# EAGLE design MobSenDat2 (EAGLE 5.11)
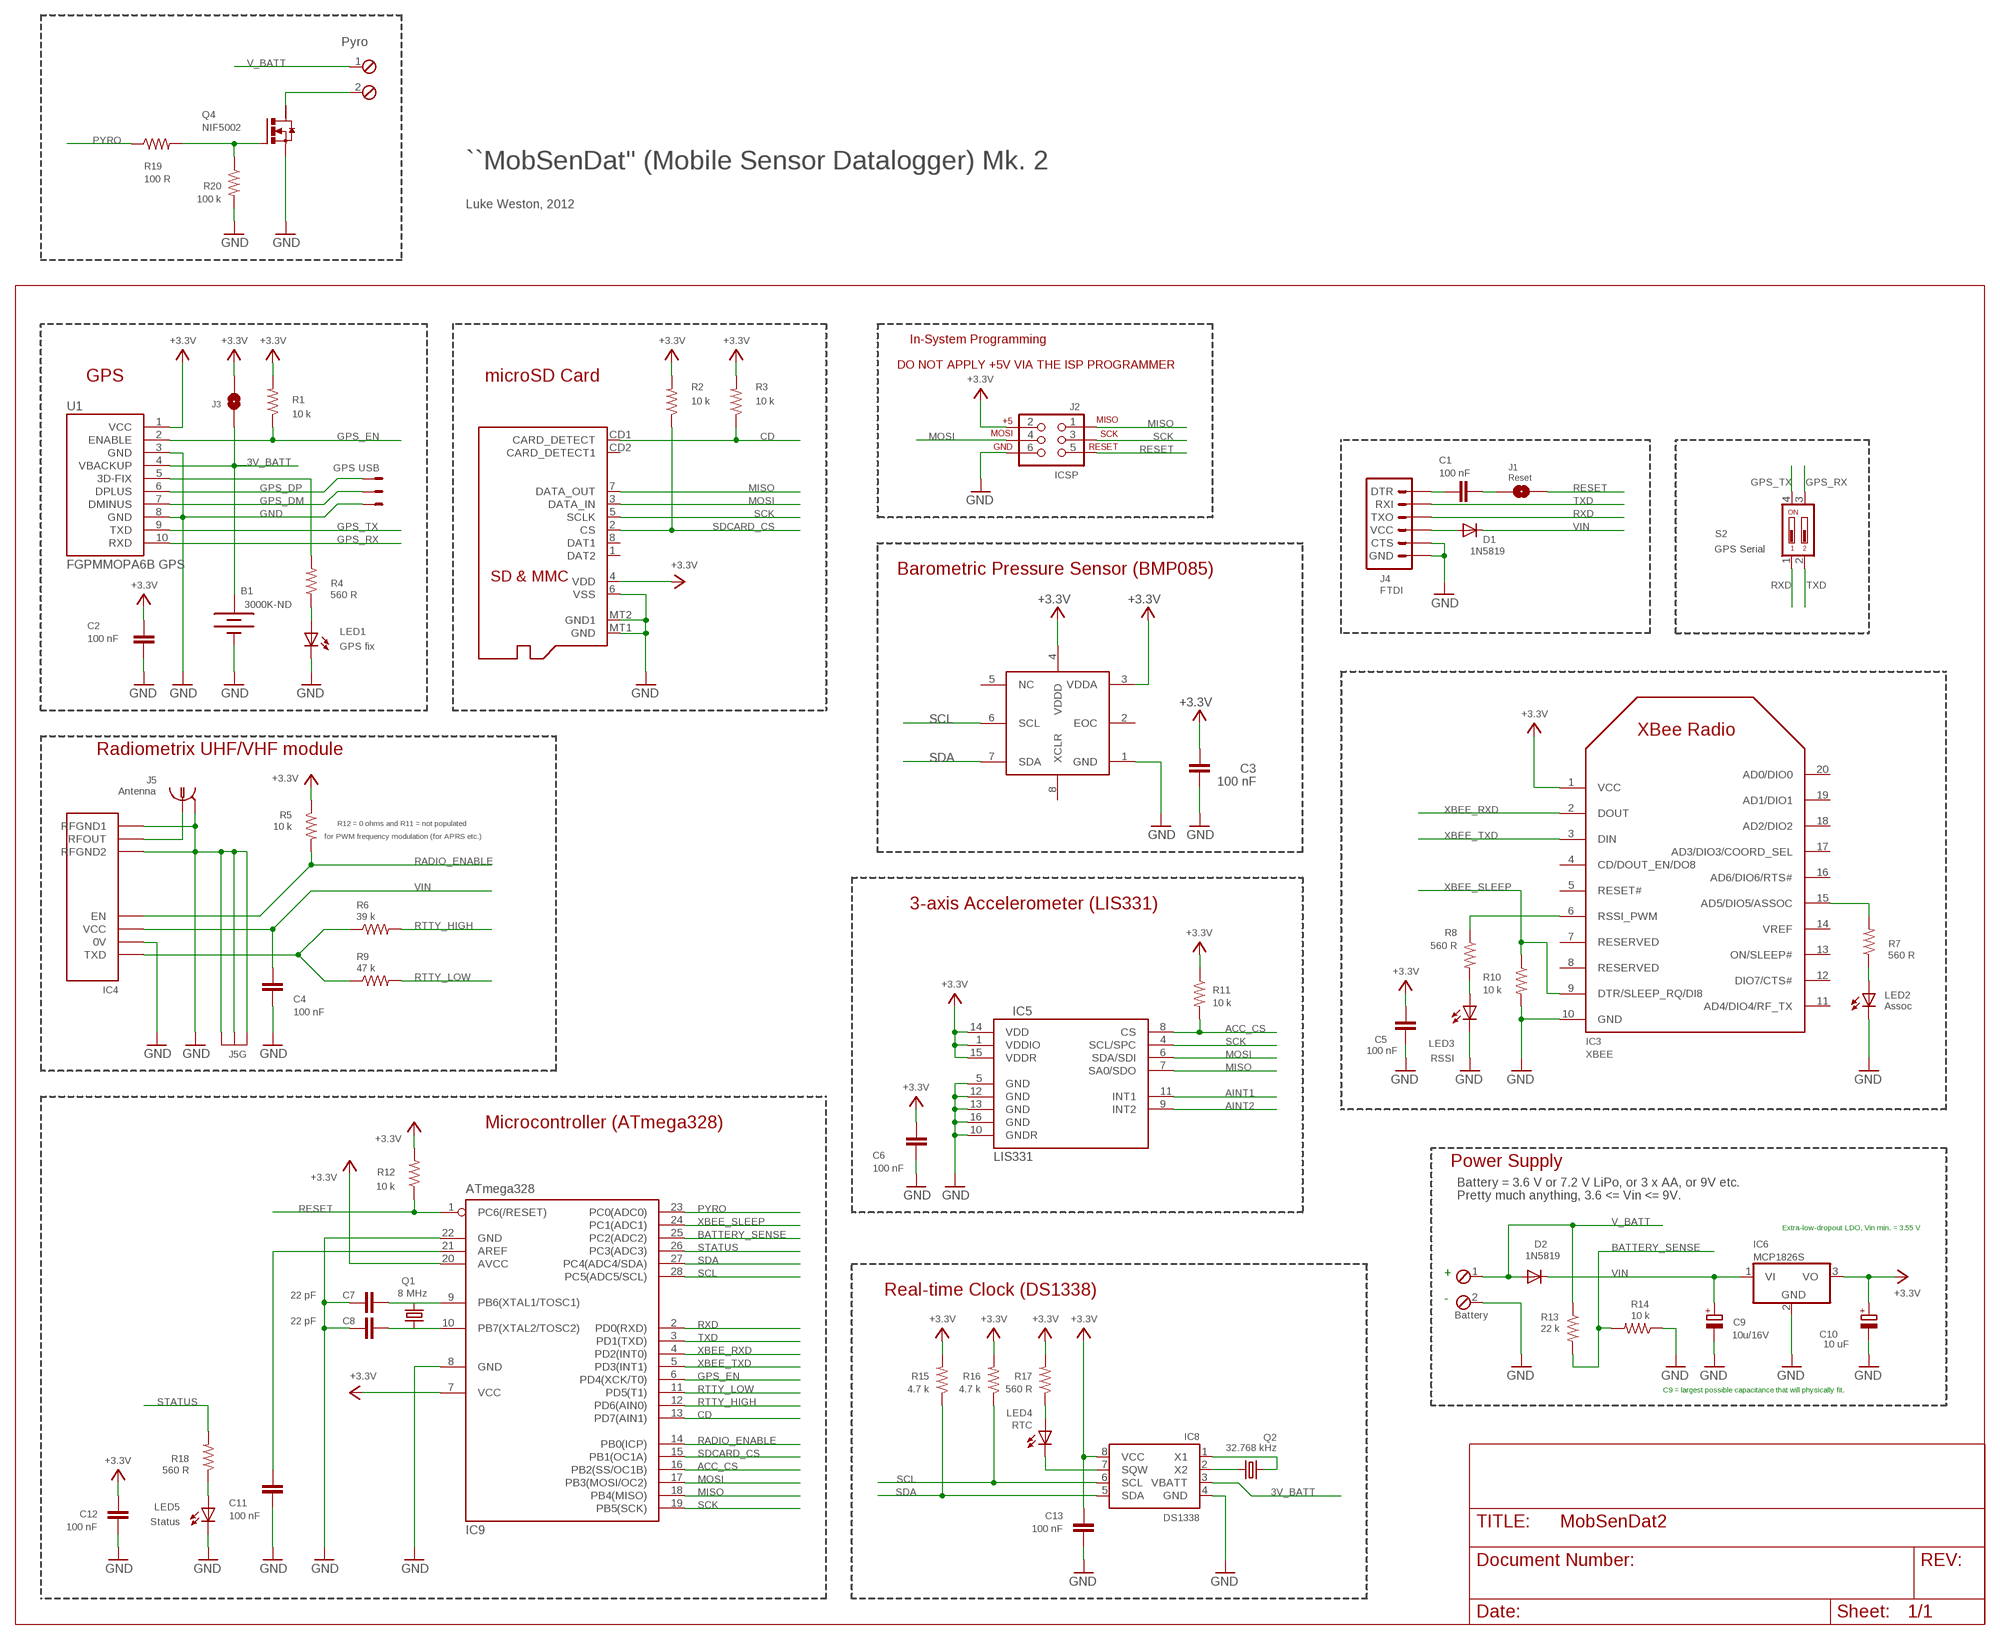
[diagram p0: schematic, sheet 1]

## Parts
B1  3000K-ND  BATTERY12MM  [BATTCON_12MM]
C1  100 nF  C-EU025-024X044  [C025-024X044]
C2  100 nF  C-EU025-024X044  [C025-024X044]
C3  100 nF  C-EU025-024X044  [C025-024X044]
C4  100 nF  C-EU025-024X044  [C025-024X044]
C5  100 nF  C-EU025-024X044  [C025-024X044]
C6  100 nF  C-EU025-024X044  [C025-024X044]
C7  22 pF  C-EU025-024X044  [C025-024X044]
C8  22 pF  C-EU025-024X044  [C025-024X044]
C9  10u/16V  CPOL-EUE2.5-5  [E2,5-5]
C10  10 uF  CPOL-EUE2.5-5  [E2,5-5]
C11  100 nF  C-EU025-024X044  [C025-024X044]
C12  100 nF  C-EU025-024X044  [C025-024X044]
C13  100 nF  C-EU025-024X044  [C025-024X044]
D1  1N5819  DIODE-DO35-10  [DO35-10]
D2  1N5819  DIODE-DO35-10  [DO35-10]
IC2  BMP085  [BMP085]
IC3  XBEE  XBEE-PRO  [XBEE-PRO]
IC4  HX1  [HX1]
IC5  LIS331  [LGA16-3MM]
IC6  MCP1826S  MCP1703DB  [SOT223]
IC8  DS1338  DS1307SO8  [SO08]
IC9  ATmega328  MEGA8-P  [DIL28-3]
J1  Reset  SJ  [SJ]
J2  ICSP  AVR_SPI_PRG_6PTH  [2X3]
J3  SJ  [SJ]
J4  FTDI  ARDUINO_SERIAL_PROGRAMLONGPADS  [1X06_LONGPADS]
J5  Antenna  LTI-SASF54GT  [LTI-SASF54GT]
LED1  GPS fix  LED3MM  [LED3MM]
LED2  Assoc  LED3MM  [LED3MM]
LED3  RSSI  LED3MM  [LED3MM]
LED4  RTC  LED3MM  [LED3MM]
LED5  Status  LED3MM  [LED3MM]
Q1  8 MHz  CRYSTALHC49UV  [HC49U-V]
Q2  32.768 kHz  CRYSTALTC38H  [TC38H]
Q4  NIF5002  N-HEXFET-2D_SOT232-  [SOT223]
R1  10 k  R-US_0207/10  [0207/10]
R2  10 k  R-US_0207/10  [0207/10]
R3  10 k  R-US_0207/10  [0207/10]
R4  560 R  R-US_0207/10  [0207/10]
R5  10 k  R-US_0207/10  [0207/10]
R6  39 k  R-US_0207/10  [0207/10]
R7  560 R  R-US_0207/10  [0207/10]
R8  560 R  R-US_0207/10  [0207/10]
R9  47 k  R-US_0207/10  [0207/10]
R10  10 k  R-US_0207/10  [0207/10]
R11  10 k  R-US_0207/10  [0207/10]
R12  10 k  R-US_0207/10  [0207/10]
R13  22 k  R-US_0207/10  [0207/10]
R14  10 k  R-US_0207/10  [0207/10]
R15  4.7 k  R-US_0207/10  [0207/10]
R16  4.7 k  R-US_0207/10  [0207/10]
R17  560 R  R-US_0207/10  [0207/10]
R18  560 R  R-US_0207/10  [0207/10]
R19  100 R  R-US_0207/10  [0207/10]
R20  100 k  R-US_0207/10  [0207/10]
S2  GPS Serial  DIP02YL  [DIP02YL]
U1  FGPMMOPA6B GPS  OPENPILOT_FGPMMOPA6B  [OPENPILOT_GTOP-FGPMMOPA6B]
U$1  MICROSD  [MICROSD]
X1  GPS USB  22-23-2031  [22-23-2031]
X2  Battery  MPT2  [2POL254]
X3  Pyro  MPT2  [2POL254]

## Nets
3V_BATT: B1.PWR@1(+) IC8.3(VBATT) J3.1 U1.4(VBACKUP)
+3.3V: C2.2 C3.2 C5.2 C6.1 C10.+ C12.2 C13.1 IC2.3(VDDA) IC2.4(VDDD) IC3.1(VCC) IC5.1(VDDIO) IC5.14(VDD) IC5.15(VDDR) IC6.3(VO) IC8.8(VCC) IC9.7(VCC) IC9.20(AVCC) J2.2 J3.2 R1.2 R2.2 R3.2 R5.1 R11.1 R12.2 R15.2 R16.2 R17.2 U1.1(VCC) U$1.4(VDD)
ACC_CS: IC5.8(CS) IC9.16(PB2(SS/OC1B)) R11.2
AINT1: IC5.11(INT1)
AINT2: IC5.9(INT2)
BATTERY_SENSE: IC9.25(PC2(ADC2)) R13.2 R14.2
CD: IC9.13(PD7(AIN1)) R3.1 U$1.CD1(CARD_DETECT)
GND: B1.GND(-) C2.1 C3.1 C4.1 C5.1 C6.2 C7.1 C8.1 C9.- C10.- C11.1 C12.1 C13.2 IC2.1(GND) IC3.10(GND) IC4.0V IC4.RFGND1 IC4.RFGND2 IC5.5(GND) IC5.10(GNDR) IC5.12(GND) IC5.13(GND) IC5.16(GND) IC6.2(GND) IC8.4(GND) IC9.8(GND) IC9.22(GND) J2.6 J4.5(CTS) J4.6(GND) J5.2(GND) J5.3(GND) J5.4(GND) J5.5(GND) LED1.K(C) LED2.K(C) LED3.K(C) LED5.K(C) Q4.3(S) R10.2 R14.1 R20.2 U1.3(GND) U1.8(GND) U$1.6(VSS) U$1.MT1(GND) U$1.MT2(GND1) X1.3 X2.2
GPS_DM: U1.7(DMINUS) X1.2
GPS_DP: U1.6(DPLUS) X1.1
GPS_EN: IC9.6(PD4(XCK/T0)) R1.1 U1.2(ENABLE)
GPS_RX: S2.3 U1.10(RXD)
GPS_TX: S2.4 U1.9(TXD)
MISO: IC5.7(SA0/SDO) IC9.18(PB4(MISO)) J2.1 U$1.7(DATA_OUT)
MOSI: IC5.6(SDA/SDI) IC9.17(PB3(MOSI/OC2)) J2.4 U$1.3(DATA_IN)
N$1: C7.2 IC9.9(PB6(XTAL1/TOSC1)) Q1.2
N$2: C8.2 IC9.10(PB7(XTAL2/TOSC2)) Q1.1
N$3: C11.2 IC9.21(AREF)
N$4: C1.2 J4.1(DTR)
N$5: LED1.A R4.1
N$6: Q4.2(D) X3.2
N$7: D1.A J4.4(VCC)
N$8: Q4.1(G) R19.2 R20.1
N$10: IC4.RFOUT J5.1
N$14: IC8.1(X1) Q2.1
N$16: IC3.15(AD5/DIO5/ASSOC) R7.2
N$17: IC8.2(X2) Q2.2
N$19: IC3.6(RSSI_PWM) R8.1
N$21: LED3.A R8.2
N$22: LED2.A R7.1
N$23: LED5.A R18.1
N$26: LED4.A R17.1
N$28: IC8.7(SQW) LED4.K(C)
N$33: R4.2 U1.5(3D-FIX)
N$56: C1.1 J1.2
PYRO: IC9.23(PC0(ADC0)) R19.1
RADIO_ENABLE: IC4.EN IC9.14(PB0(ICP)) R5.2
RESET: IC9.1(PC6(/RESET)) J1.1 J2.5 R12.1
RTTY_HIGH: IC9.12(PD6(AIN0)) R6.2
RTTY_LOW: IC9.11(PD5(T1)) R9.2
RXD: IC9.2(PD0(RXD)) J4.3(TXO) S2.1
SCK: IC5.4(SCL/SPC) IC9.19(PB5(SCK)) J2.3 U$1.5(SCLK)
SCL: IC2.6(SCL) IC8.6(SCL) IC9.28(PC5(ADC5/SCL)) R16.1
SDA: IC2.7(SDA) IC8.5(SDA) IC9.27(PC4(ADC4/SDA)) R15.1
SDCARD_CS: IC9.15(PB1(OC1A)) R2.1 U$1.2(CS)
STATUS: IC9.26(PC3(ADC3)) R18.2
TXD: IC9.3(PD1(TXD)) J4.2(RXI) S2.2
TXD2: IC4.TXD R6.1 R9.1
V_BATT: D2.A R13.1 X2.1 X3.1
VIN: C4.2 C9.+ D1.C D2.C IC4.VCC IC6.1(VI)
XBEE_RXD: IC3.2(DOUT) IC9.4(PD2(INT0))
XBEE_SLEEP: IC3.9(DTR/SLEEP_RQ/DI8) IC9.24(PC1(ADC1)) R10.1
XBEE_TXD: IC3.3(DIN) IC9.5(PD3(INT1))
Unconnected: IC2.2(EOC) IC2.5(NC) IC2.8(XCLR) IC3.4(CD/DOUT_EN/DO8) IC3.5(RESET#) IC3.7(RESERVED) IC3.8(RESERVED) IC3.11(AD4/DIO4/RF_TX) IC3.12(DIO7/CTS#) IC3.13(ON/SLEEP#) IC3.14(VREF) IC3.16(AD6/DIO6/RTS#) IC3.17(AD3/DIO3/COORD_SEL) IC3.18(AD2/DIO2) IC3.19(AD1/DIO1) IC3.20(AD0/DIO0) Q4.4(D) U$1.1(DAT2) U$1.8(DAT1) U$1.CD2(CARD_DETECT1)

## Notes on the sheet
- ``MobSenDat" (Mobile Sensor Datalogger) Mk. 2
- Luke Weston, 2012
- In-System Programming
- GPS | DO NOT APPLY +5V VIA THE ISP PROGRAMMER
- microSD Card
- Barometric Pressure Sensor (BMP085)
- Radiometrix UHF/VHF module
- R12 = 0 ohms and R11 = not populated
- for PWM frequency modulation (for APRS etc.)
- 3-axis Accelerometer (LIS331)
- Microcontroller (ATmega328)
- Power Supply
- Battery = 3.6 V or 7.2 V LiPo, or 3 x AA, or 9V etc.
- Pretty much anything, 3.6 <= Vin <= 9V.
- Extra-low-dropout LDO, Vin min. = 3.55 V
- +
- Real-time Clock (DS1338)
- -
- C9 = largest possible capacitance that will physically fit.

## Library data of the parts
B1 = SparkFun:BATTERY: Battery Holders Various common sizes : AA, AAA, 20mm coin cell and 12mm coin cell.
C1-C8 C11-C13 = rcl:C-EU: CAPACITOR, European symbol
C9 C10 = rcl:CPOL-EU: POLARIZED CAPACITOR, European symbol
D1 D2 = diode:DIODE-: DIODE
IC2 = SparkFun:BMP085
IC3 = xbee_r1:XBEE
IC4 = trackuino:HX1
IC5 = SparkFun:LIS331: LIS331HH 3-axis accelerometer
IC6 = linear:MCP1703: 250 mA, 16V, Low Quiescent Current LDO Regulator Source: http://ww1.microchip.com/downloads/en/DeviceDoc/22049b.pdf
IC8 = SparkFun:DS1307
IC9 = atmel:MEGA8-P: MICROCONTROLLER 8 Kbytes FLASH, 1 kbytes SRAM, 512 bytes EEPROM, USART, 4-channel 10 bit ADC, 2-channel 8 bit ADC Pin compatible with Atmega48, ATMega88, ATMega168 Source: avr.lbr; OC_FARNELL: unknown; OC_NEWARK: unknown
J1 J3 = jumper:SJ: SMD solder JUMPER
J2 = SparkFun:AVR_SPI_PRG_6: AVR ISP 6 Pin This is the reduced ISP connector for AVR programming. Common on Arduino. This footprint will take up less PCB space and can be used with a 10-pin to 6-pin adapter such as SKU: BOB-08508
J4 = SparkFun:ARDUINO_SERIAL_PROGRAM
J5 = con-coax:LTI-SASF54GT: SMA vertical PCB thrue hole jack Source: Lighthorse Technologies, inc. SASF54GT.pdf; OC_FARNELL: unknown; OC_NEWARK: unknown
LED1-LED5 = led:LED: LED OSRAM: - CHIPLED LG R971, LG N971, LY N971, LG Q971, LY Q971, LO R971, LY R971 LH N974, LH R974 LS Q976, LO Q976, LY Q976 LO Q996 - Hyper CHIPLED LW Q18S LB Q993, LB Q99A, LB R99A - SideLED LS A670, LO A670, LY A670, LG A670, LP A670 LB A673, LV A673, LT A673, LW A673 LH A674 LY A675 LS A676, LA A676, LO A676, LY A676, LW A676 LS A679, LY A679, LG A679 - Hyper Micro SIDELED® LS Y876, LA Y876, LO Y876, LY Y876 LT Y87S - SmartLED LW L88C, LW L88S LB L89C, LB L89S, LG L890 LS L89K, LO L89K, LY L89K LS L896, LA L896, LO L896, LY L896 - TOPLED LS T670, LO T670, LY T670, LG T670, LP T670 LSG T670, LSP T670, LSY T670, LOP T670, LYG T670 LG T671, LOG T671, LSG T671 LB T673, LV T673, LT T673, LW T673 LH T674 LS T676, LA T676, LO T676, LY T676, LB T676, LH T676, LSB T676, LW T676 LB T67C, LV T67C, LT T67C, LS T67K, LO T67K, LY T67K, LW E67C LS E67B, LA E67B, LO E67B, LY E67B, LB E67C, LV E67C, LT E67C LW T67C LS T679, LY T679, LG T679 LS T770, LO T770, LY T770, LG T770, LP T770 LB T773, LV T773, LT T773, LW T773 LH T774 LS E675, LA E675, LY E675, LS T675 LS T776, LA T776, LO T776, LY T776, LB T776 LHGB T686 LT T68C, LB T68C - Hyper Mini TOPLED® LB M676 - Mini TOPLED Santana® LG M470 LS M47K, LO M47K, LY M47K Source: http://www.osram.convergy.de LUXEON: - LUMILED® LXK2-PW12-R00, LXK2-PW12-S00, LXK2-PW14-U00, LXK2-PW14-V00 LXK2-PM12-R00, LXK2-PM12-S00, LXK2-PM14-U00 LXK2-PE12-Q00, LXK2-PE12-R00, LXK2-PE12-S00, LXK2-PE14-T00, LXK2-PE14-U00 LXK2-PB12-K00, LXK2-PB12-L00, LXK2-PB12-M00, LXK2-PB14-N00, LXK2-PB14-P00, LXK2-PB14-Q00 LXK2-PR12-L00, LXK2-PR12-M00, LXK2-PR14-Q00, LXK2-PR14-R00 LXK2-PD12-Q00, LXK2-PD12-R00, LXK2-PD12-S00 LXK2-PH12-R00, LXK2-PH12-S00 LXK2-PL12-P00, LXK2-PL12-Q00, LXK2-PL12-R00 Source: www.luxeon.com KINGBRIGHT: KA-3528ASYC Source: www.kingbright.com
Q1 = SparkFun:CRYSTAL: Crystals Various standard crystals. Proven footprints. Spark Fun Electronics SKU : COM-00534
Q2 = crystal:CRYSTAL: CRYSTAL; OC_FARNELL: unknown; OC_NEWARK: unknown
Q4 = transistor-power:N-HEXFET-2D_?-*: HEXFET® Power MOSFET 2 Drain connects http://www.irf.com/product-info/datasheets/data/irll014n.pdf
R1-R20 = adafruit:R-US_: RESISTOR, American symbol
S2 = switch-dil:DIP02YL: DIL/CODE SWITCH; OC_FARNELL: unknown; OC_NEWARK: unknown
U1 = MobSenDat2:OPENPILOT_FGPMMOPA6B: GTOP FGPMMOPA6B GPS POT (Patch-On-Top) Module 66-channel GPS Engine Board
U$1 = adafruit:MICROSD: Micro-SD / Transflash card holder with SPI pinout For the 3M # 2908-05WB-MG and/or 4UCON #19656 push-push type
X1 = con-molex:22-23-2031: .100" (2.54mm) Center Header - 3 Pin; MF: MOLEX; MPN: 22-23-2031; OC_FARNELL: 1462950; OC_NEWARK: 30C0862
X2 X3 = con-phoenix-254:MPT2: PHOENIX CONNECTOR; OC_FARNELL: unknown; OC_NEWARK: unknown

## Net classes
1 vcc: width 0.254 mm

## Board
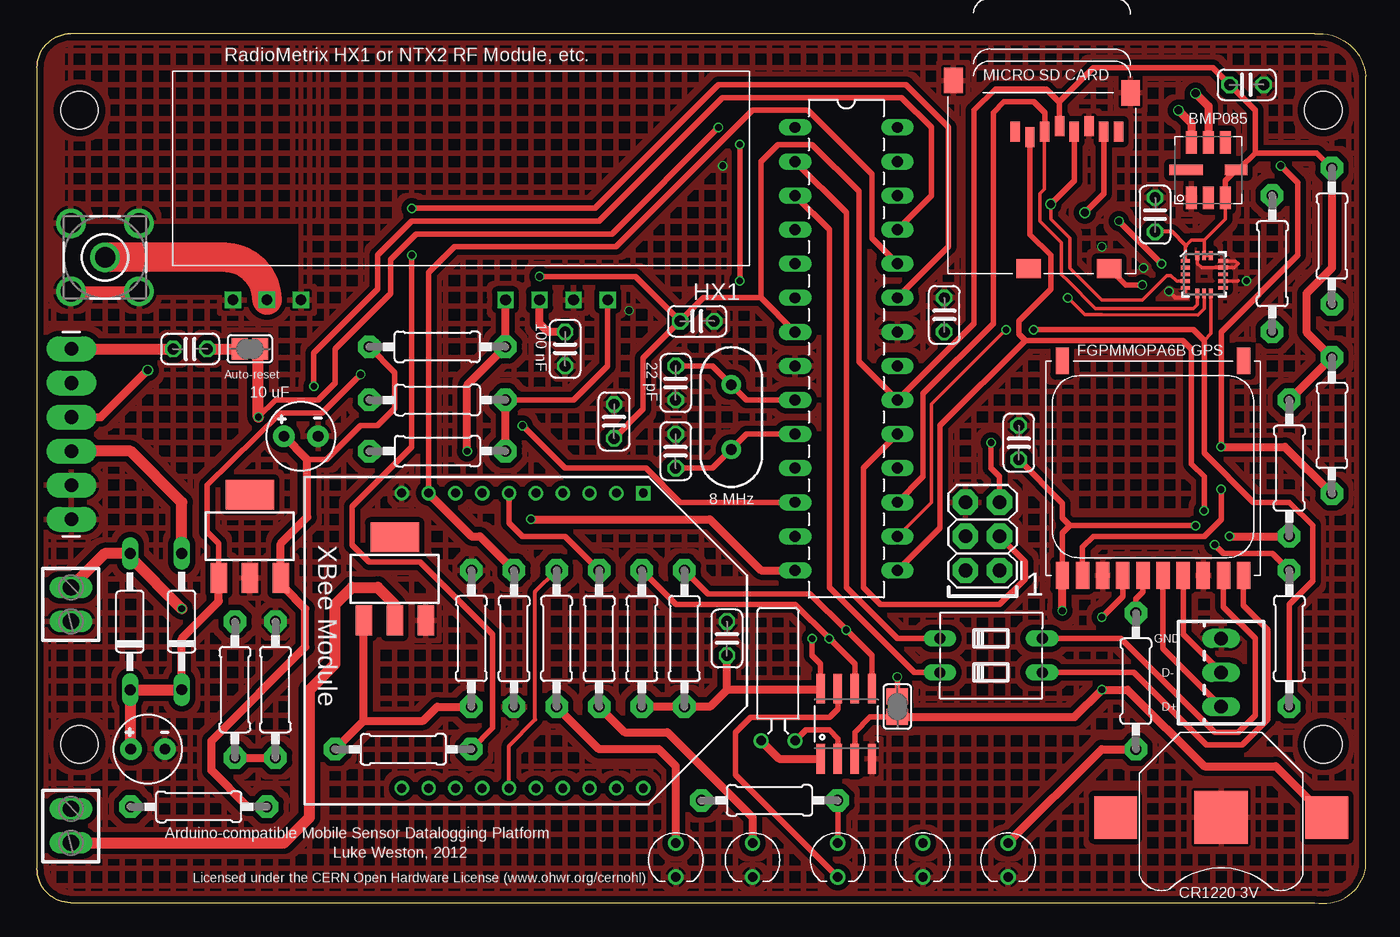
[diagram p1: board, top side]
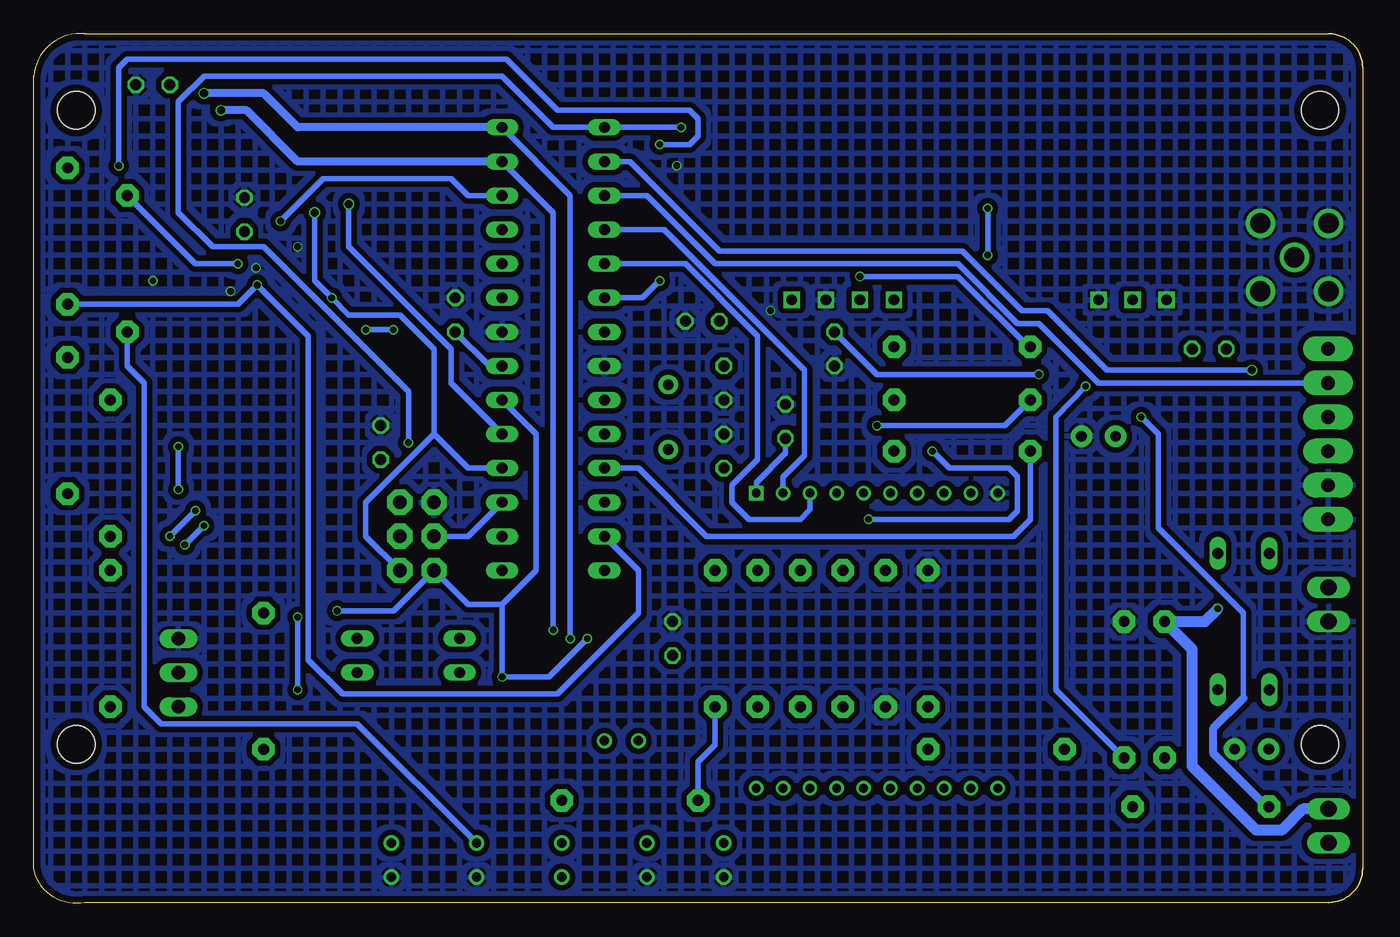
[diagram p2: board, bottom side, seen from below]

Size 99.06 x 64.85 mm. Coordinates in mm from the lower left corner, seen from the top.
Outline: 0,2.6 arc90 2.54,0.06
Outline: 2.54,0.06 arc-90 0,2.6
Outline: 0,62.29 arc-90 2.54,64.83
Outline: 2.54,64.83 arc90 0,62.29
Outline: 0,62.29 0,2.6
Outline: 2.54,64.83 95.25,64.83 arc-90 99.06,61.66 99.06,2.6 arc-90 95.25,0.06 2.54,0.06
Copper layers (1*16): Top 0.035mm / dielectric 1.5mm / Bottom 0.035mm
Design rules "PCBCart-.3mmHoles-.1mmAnnulars": minimum track width 8mil, minimum drill 0.3mm, track to track 8mil, track to pad 8mil, pad to pad 8mil, via to via 8mil, smd to smd 8mil, copper to edge 20mil, drill to drill 8mil, minimum pad ring 8mil, minimum via ring 4mil, stop-mask expansion 3mil, vias tented up to drill 0mil, thermal gap 8mil
Holes 2.8 mm at 3.17,11.87 95.89,59.12 3.17,59.12 95.89,11.87

### Footprints (pad centres in the part's own frame; a part is rotated, then mirrored left to right if it is on the bottom)
BATTCON_12MM = smd 3.962 x 3.962: GND 0,0 | smd 3.175 x 3.175: PWR@1 -7.874,0; PWR@2 7.874,0
C025-024X044 = drill 0.813 octagon: 1 -1.27,0; 2 1.27,0
E2,5-5 = drill 0.8 pad 1.6 round: + -1.27,0; - 1.27,0
DO35-10 = drill 0.813 long: A 5.08,0; C -5.08,0
BMP085 = smd 1.67 x 0.8: 1 -2.065,1.27; 2 -2.065,0; 3 -2.065,-1.27; 5 2.065,-1.27; 6 2.065,0; 7 2.065,1.27 | smd 0.8 x 1.67: 4 0,-2.065 | smd 0.8 x 2.5: 8 0,1.65
XBEE-PRO = drill 0.66 square: 1 -11,9 | drill 0.66 round: 2 -11,7; 3 -11,5; 4 -11,3; 5 -11,1; 6 -11,-1; 7 -11,-3; 8 -11,-5; 9 -11,-7; 10 -11,-9; 11 11,-9; 12 11,-7; 13 11,-5; 14 11,-3; 15 11,-1; 16 11,1; 17 11,3; 18 11,5; 19 11,7; 20 11,9
HX1 = drill 0.8 square: 0V 25.4,-8.89; EN 20.32,-8.89; RFGND1 0,-8.89; RFGND2 5.08,-8.89; RFOUT 2.54,-8.89; TXD 27.94,-8.89; VCC 22.86,-8.89
LGA16-3MM = smd 0.7 x 0.28: 1 -1.4,1; 2 -1.4,0.5; 3 -1.4,0; 4 -1.4,-0.5; 5 -1.4,-1; 9 1.4,-1; 10 1.4,-0.5; 11 1.4,0; 12 1.4,0.5; 13 1.4,1 | smd 0.28 x 0.7: 6 -0.5,-1.4; 7 0,-1.4; 8 0.5,-1.4; 14 0.5,1.4; 15 0,1.4; 16 -0.5,1.4
SOT223 = smd 1.219 x 2.235: 1 -2.311,-3.099; 2 0,-3.099; 3 2.311,-3.099 | smd 3.6 x 2.2: 4 0,3.099
SO08 = smd 0.61 x 2.21: 1 -1.905,-2.616; 2 -0.635,-2.616; 3 0.635,-2.616; 4 1.905,-2.616; 5 1.905,2.616; 6 0.635,2.616; 7 -0.635,2.616; 8 -1.905,2.616
DIL28-3 = drill 0.813 long: 1 -16.51,-3.81; 2 -13.97,-3.81; 3 -11.43,-3.81; 4 -8.89,-3.81; 5 -6.35,-3.81; 6 -3.81,-3.81; 7 -1.27,-3.81; 8 1.27,-3.81; 9 3.81,-3.81; 10 6.35,-3.81; 11 8.89,-3.81; 12 11.43,-3.81; 13 13.97,-3.81; 14 16.51,-3.81; 15 16.51,3.81; 16 13.97,3.81; 17 11.43,3.81; 18 8.89,3.81; 19 6.35,3.81; 20 3.81,3.81; 21 1.27,3.81; 22 -1.27,3.81; 23 -3.81,3.81; 24 -6.35,3.81; 25 -8.89,3.81; 26 -11.43,3.81; 27 -13.97,3.81; 28 -16.51,3.81
SJ = smd 1.168 x 1.6: 1 -0.762,0; 2 0.762,0
2X3 = drill 1.016 pad 1.88 octagon: 1 0,0; 2 0,2.54; 3 2.54,0; 4 2.54,2.54; 5 5.08,0; 6 5.08,2.54
1X06_LONGPADS = drill 1.016 pad 1.88 long: 1 0,0; 2 2.54,0; 3 5.08,0; 4 7.62,0; 5 10.16,0; 6 12.7,0
LTI-SASF54GT = drill 1.5 pad 2.2 round: 1 0,0; 2 -2.54,2.54; 3 2.54,2.54; 4 2.54,-2.54; 5 -2.54,-2.54
LED3MM = drill 0.7 pad 1.143 round: A -1.27,0; K 1.27,0
HC49U-V = drill 0.8 pad 1.422 round: 1 -2.413,0; 2 2.413,0
TC38H = drill 0.7 round: 1 -1.27,0; 2 1.27,0
0207/10 = drill 0.813 pad 1.676 octagon: 1 -5.08,0; 2 5.08,0
DIP02YL = drill 0.813 long: 1 -1.27,-3.81; 2 1.27,-3.81; 3 1.27,3.81; 4 -1.27,3.81
OPENPILOT_GTOP-FGPMMOPA6B = smd 2 x 1: 1 -8,6.75; 2 -8,5.25; 3 -8,3.75; 4 -8,2.25; 5 -8,0.75; 6 -8,-0.75; 7 -8,-2.25; 8 -8,-3.75; 9 -8,-5.25; 10 -8,-6.75; 11 8,-6.75; 12 8,6.75
MICROSD = smd 0.7 x 1.5: 1 9,-10.64; 2 7.9,-10.24; 3 6.8,-10.64; 4 5.7,-11.04; 5 4.6,-10.64; 6 3.5,-11.04; 7 2.4,-10.64; 8 1.3,-10.64 | smd 1.8 x 1.4: CD1 2,-0.44; CD2 8,-0.44 | smd 1.4 x 1.9: MT1 0.4,-13.54; MT2 13.6,-14.44
22-23-2031 = drill 1 long: 1 -2.54,0; 2 0,0; 3 2.54,0
2POL254 = drill 1.2 long: 1 -1.27,0; 2 1.27,0

### Placement (x,y rotation side)
B1  88.27,6.41 180 top
C1  11.43,41.33 180 top
C2  73.18,34.35 270 top
C3  90.17,61.02 180 top
C4  39.37,41.34 90 top
C5  43.02,35.94 270 top
C6  83.34,51.34 90 top
C7  47.61,38.8 90 top
C8  47.61,33.72 270 top
C9  8.27,11.51 0 top
C10  19.68,34.83 0 top
C11  67.63,43.88 270 top
C12  49.21,43.4 180 top
C13  51.44,19.75 90 top
D1  10.79,21.02 90 top
D2  6.94,21.01 90 top
IC2  87.31,54.67 90 top
IC3  36.2,19.59 270 top
IC4  14.61,53.88 0 top
IC5  87,46.89 0 top
IC6  15.88,27.37 0 top
IC8  60.33,13.4 0 top
IC9  60.33,41.34 270 top
J1  15.88,41.34 180 top
J2  71.75,24.83 90 top
J3  64.14,14.67 90 top
J4  2.57,41.34 270 top
J5  5.08,48.16 0 top
LED1  72.39,3.24 270 top
LED2  47.62,3.24 270 top
LED3  53.34,3.24 270 top
LED4  59.69,3.24 270 top
LED5  66.04,3.24 270 top
Q1  51.75,36.26 90 top
Q2  55.24,12.13 0 top
Q4  26.67,24.19 0 top
R1  96.52,35.62 90 top
R2  93.34,32.45 90 top
R3  96.52,49.75 90 top
R4  81.92,16.57 90 top
R5  29.84,41.5 0 top
R6  29.84,37.53 180 top
R7  38.73,19.75 90 top
R8  41.91,19.75 270 top
R9  29.84,33.72 180 top
R10  35.56,19.75 270 top
R11  93.34,19.75 270 top
R12  12.06,7.21 0 top
R13  14.76,15.94 270 top
R14  17.78,15.94 270 top
R15  48.26,19.75 270 top
R16  45.09,19.75 270 top
R17  54.61,7.68 180 top
R18  92.08,47.69 90 top
R19  27.3,11.49 180 top
R20  32.38,19.75 90 top
S2  71.12,18.48 270 top
U1  83.19,32.45 90 top
U$1  81.92,46.89 180 top
X1  88.27,17.21 90 top
X2  2.54,22.29 270 top
X3  2.54,5.78 270 top

### Tracks (layer width: path | path; a pad name or v marks a point on that pad's centre or on a via)
3V_BATT  (via drill 0.5)
  Top 0.406: v79.38,21.34 80.94,22.89 U1.4 | IC8.3 60.96,12.76 62.1,13.91 J3.1
  Top 0.61: B1.PWR@1 92.33,10.22 87,10.22 81.28,15.94 v79.38,15.94 77.34,13.91 J3.1
  Bottom 0.406: v79.38,15.94 v79.38,21.34
+3.3V  (via drill 0.5)
  Top 0.254: IC5.14 IC5.15 87,49.43 | 87,49.43 88.58,51.02 IC2.3 | IC5.1 85.59,48.99 85.65,49.04 86.04,49.43 87,49.43 | 87,49.43
  Top 0.305: C6.1 84.61,50.07 85.65,49.04
  Top 0.406: 89.69,54.67 IC2.4 88.58,53.88 IC2.3 | 89.69,54.67 | v57.78,19.75 57.78,18.48 58.42,17.84 IC8.8 58.34,15.94 | R11.1 92.08,26.1 88.42,26.1 v87.79,26.73 | 89.69,54.67 89.69,54.83 90.81,55.94 | 90.81,55.94 | C5.2 45.2,36.84 45.2,40.65 C12.2 | C2.2 76.44,29.83 76.44,28.72 76.99,28.16 | 76.99,28.16 v86.36,28.16 | 76.99,28.16 76.44,27.6 U1.1 | R5.1 26.67,39.59 26.67,36.89 25.4,35.62 24.13,35.62 21.59,33.08 20.16,33.08 | 18.41,23.56 18.41,24.04 IC6.3 | 90.81,55.94 95.41,55.94 R3.2 | v64.14,16.89 J3.2 | 53.98,45.15 53.98,55.31 55.24,56.58 57.78,56.58 61.28,53.09 61.28,40.38 IC9.20 69.85,43.24 69.85,59.12 71.44,60.7 75.25,60.7 76.22,59.74 U$1.4 76.22,59.77 78.74,62.29 87.63,62.29 C3.2 90.81,59.12 90.81,55.94 | 53.98,45.15 IC9.7 | 53.98,45.15 49.69,45.15 C12.2 | v37.47,46.73 44.61,46.73 C12.2
  Top 0.61: R16.2 R15.2 50.16,14.67 51.44,15.94 | 51.44,15.94 C13.1 | 58.34,15.94 51.44,15.94 | 18.41,23.56 20,21.97 20,19.11 13.02,12.13 13.02,9.9 15.72,7.21 R12.2 | R2.2 R1.2 94.61,42.61 94.61,45.47 96.52,47.37 R3.2 | IC6.3 18.19,26.82 20.16,28.8 20.16,33.08 C10.+ | v76.44,21.81 U1.1
  Bottom 0.406: 61.59,26.1 61.59,24.83 | v76.44,21.81 75.88,21.81 72.23,21.81 J2.2 66.67,22.29 64.14,22.29 | 61.59,26.1 61.59,24.83 | 61.59,24.83 64.14,22.29 | R5.1 24.92,41.5 30.16,46.73 v37.47,46.73 | v86.36,28.16 v87.79,26.73 | 64.14,22.29 v64.14,16.89 60.64,16.89 v57.78,19.75 | IC3.1 45.2,31.39 43.02,33.56 43.02,34.35 C5.2 | R17.2 49.53,10.54 48.26,11.81 R15.2 | IC9.20 61.59,34.99 61.59,26.1
ACC_CS  (via drill 0.5)
  Top 0.254: IC5.8 87.5,42.47 87,41.97 | v72.23,42.77 66.67,37.21 66.67,29.91 IC9.16
  Top 0.406: R11.2 93.34,22.29 95.09,24.03 95.09,28.16 93.34,29.91 90.65,29.91 87,33.56 87,41.97 86.2,42.77 v74.3,42.77
  Bottom 0.406: v72.23,42.77 v74.3,42.77
BATTERY_SENSE  (via drill 0.5)
  Top 0.406: v20.64,38.56 20.64,41.02 25.4,45.78 25.4,48.32 27.94,50.86 41.91,50.86 51.12,60.07 64.45,60.07 66.67,57.85 66.67,52.77 IC9.25
  Top 0.61: R13.2 R14.2
  Bottom 0.406: R14.2 20.95,14.03 | 20.95,14.03 | 20.95,14.03 22.86,15.94 22.86,36.26 v20.64,38.56
CD  (via drill 0.5)
  Top 0.406: v82.39,46.1 81.15,46.1 U$1.CD1
  Bottom 0.406: R3.1 83.82,44.67 v82.39,46.1 78.58,42.29 78.58,18.16 76.04,15.62 60.01,15.62 53.98,21.65 53.98,24.83 IC9.13
GND  (via drill 0.5)
  Top 0.254: IC5.16 86.5,47.71 86.81,47.39 IC5.12 89.24,47.39 89.53,47.69 89.33,47.89 IC5.13 | IC5.10 89.51,46.39 89.53,46.42
  Top 0.305: IC5.5 85.59,45.28 85.72,45.15 84.85,45.15 v84.38,45.62
  Top 0.813: J5.5 J5.4
  other vias: 79.38,48.96 82.47,47.37 90.17,46.42 44.13,44.2 51.12,54.99
  pour Bottom (isolate 0.406, hatched): -0.64,65.47 99.69,65.47 99.69,-0.57 -0.64,-0.57
  pour Top (isolate 0.406, hatched): 19.68,45.15 19.68,65.47 99.69,65.47 99.69,-0.57 -0.64,-0.57 -0.64,45.15
  pour Top (isolate 0.406): -0.64,65.47 1.91,65.47 1.91,45.15 -0.64,45.15
  pour Top (isolate 0.406, hatched): -0.64,65.47 20.95,65.47 20.95,50.86 -0.64,50.86
GPS_DM
  Top 0.406: X1.2 85.44,20.04 U1.7
GPS_DP
  Top 0.406: X1.1 83.94,19 U1.6
GPS_EN  (via drill 0.5)
  Top 0.406: v52.39,46.42 v52.39,56.58 | v88.27,34.03 88.27,42.61 93.98,48.32 93.98,53.72 v92.71,54.99 | v88.27,30.86 88.27,28.64 87,27.37 78.74,27.37 77.94,26.56 U1.2
  Top 0.61: v88.27,34.03 93.03,34.03 R1.1
  Bottom 0.406: v52.39,56.58 50.16,56.58 49.53,57.21 49.53,58.48 50.16,59.12 60.01,59.12 63.82,62.93 92.08,62.93 92.71,62.29 v92.71,54.99 | v88.27,34.03 v88.27,30.86 | IC9.6 53.66,45.15 v52.39,46.42
GPS_RX
  Top 0.406: S2.3 81.76,17.21 87.15,11.81 89.85,11.81 91.76,13.71 91.76,20.38 89.94,22.2 U1.10
GPS_TX
  Top 0.406: S2.4 80.8,19.75 87.79,12.76 89.53,12.76 90.81,14.03 90.81,19.75 88.44,22.12 U1.9
MISO  (via drill 0.5, 0.6)
  Top 0.254: IC5.7 87,44.35 86.52,43.88 79.38,43.88 78.11,43.88 v76.83,45.15
  Top 0.406: U$1.7 79.52,52.91 v78.11,51.5
  Bottom 0.406: 69.22,34.99 74.3,29.91 74.3,27.37 J2.1 | v78.11,51.5 78.11,46.42 v76.83,45.15 75.56,43.88 71.75,43.88 69.22,41.34 69.22,34.99 | IC9.18 66.67,32.45 69.22,34.99
MOSI
  Top 0.254: IC5.6 86.5,44.65 86.2,44.35 78.9,44.35 76.83,46.42 | 76.83,46.42 | 76.83,46.42 76.36,46.89 76.36,49.27 74.77,50.86 74.77,52.93 75.09,53.24 75.09,57.51 U$1.3
  Top 0.406: U$1.3 75.11,58.93 74.3,59.75 72.07,59.75 71.28,58.96 71.28,43.24 66.04,38 66.04,31.81 IC9.17
  Bottom 0.406: J2.4 66.67,27.37 IC9.17
N$1
  Top 0.406: IC9.9 52.9,37.53 Q1.2 50.35,40.07 C7.2
N$2
  Top 0.406: IC9.10 52.9,34.99 Q1.1 50.36,32.45 C8.2
N$3
  Bottom 0.406: C11.2 65.09,40.07 IC9.21
N$4
  Top 0.406: C1.2
  Top 0.813: J4.1 C1.2
N$5
  Top 0.61: R4.1 79.38,11.49 LED1.A
N$6
  Top 0.813: X3.2 18.41,4.51 20.32,6.41 20.32,15.94 22.23,17.84 22.23,22.29 23.5,23.56 25.4,23.56 26.67,22.29 Q4.2
N$7
  Top 0.813: J4.4 6.99,33.72 10.79,29.91 D1.A
N$8
  Top 0.61: 24.36,13.63 Q4.1 | R19.2 24.36,13.63 | R20.1 29.84,14.67 28.8,13.63 24.36,13.63
N$10
  Top 2.184: J5.1 13.97,48.16 arc-90 IC4.RFOUT
N$14
  Top 0.61: IC8.1 55.32,10.78 Q2.1
N$16
  Top 0.305: IC3.15 35.2,11.76 37.15,13.71 37.15,23.24 R7.2
N$17
  Top 0.406: Q2.2 57.31,12.92 59.05,12.92 59.69,12.29 IC8.2
N$19
  Top 0.406: IC3.6 35.2,28.37 36.2,27.37 39.37,27.37 R8.1
N$21
  Top 0.61: LED3.A 53.34,6.41 46.99,12.76 43.81,12.76 R8.2
N$22
  Top 0.61: R7.1 41.91,11.49 46.35,11.49 47.62,10.22 LED2.A
N$23
  Bottom 0.406: R18.1 92.08,40.07 90.81,38.8 90.81,14.67 89.53,13.4 76.83,13.4 74.93,13.4 LED5.A
N$26
  Top 0.406: LED4.A R17.1
N$28
  Top 0.406: IC8.7 59.69,14.51 59.05,13.87 53.18,13.87 52.07,12.76 52.07,9.59 LED4.K
N$33
  Top 0.406: R4.2 81.92,22.68 82.44,23.2 U1.5
N$56
  Top 0.406: 15.24,41.33 14.92,41.33 14.93,41.34 J1.2
  Top 0.813: C1.1 14.92,41.33
PYRO  (via drill 0.5)
  Top 0.406: R19.1 33.97,13.08 33.97,20.07 28.57,25.46 24.77,25.46 23.5,26.73 23.5,29.59 27.94,34.03 v27.94,48.32 | v27.94,51.81 41.59,51.81 50.8,61.02 64.77,61.02 67.94,57.85 67.94,48.96 IC9.23
  Bottom 0.406: v27.94,48.32 v27.94,51.81
RADIO_ENABLE  (via drill 0.5)
  Top 0.61: IC4.EN R5.2 32.07,38.64 v32.07,33.72 | v36.83,28.64 50.16,28.64 53.98,24.83 IC9.14
  Bottom 0.406: 27.94,28.64 v36.83,28.64 26.35,28.64 25.72,29.27 25.72,31.81 26.35,32.45 30.8,32.45 v32.07,33.72
RESET  (via drill 0.5)
  Top 0.406: v50.8,57.85 42.86,49.91 28.26,49.91 26.35,48.01 26.35,45.47 22.23,41.34 22.23,38.8 20.95,37.53 17.78,37.53 v16.51,36.26 | J2.5 71.75,31.81 71.12,32.45 v71.12,34.35 | 16.51,41.21 J1.1
  Top 0.813: v16.51,36.26 16.51,41.21
  Bottom 0.406: v16.51,36.26 15.24,34.99 15.24,28 8.89,21.65 8.89,15.3 | v50.8,57.85 IC9.1 60.33,57.85 64.14,61.66 86.36,61.66 88.27,59.75 88.27,51.5 85.72,48.96 81.92,48.96 71.12,38.16 v71.12,34.35
  Bottom 0.61: R12.1 7.14,7.21 11.11,11.18 11.11,13.08 8.89,15.3
RTTY_HIGH  (via drill 0.5)
  Top 0.406: v36.2,35.62 39.37,32.45 45.4,32.45 47.94,29.91 IC9.12
  Bottom 0.406: v36.2,35.62 26.67,35.62 R6.2
RTTY_LOW
  Bottom 0.406: R9.2 24.77,28.64 26.04,27.37 48.9,27.37 53.98,32.45 IC9.11
RXD  (via drill 0.6)
  Top 0.406: S2.1 64.14,19.75 60.33,23.56 60.33,51.5 IC9.2 | J4.3
  Top 0.61: v8.26,39.75 4.76,36.26 J4.3
  Bottom 0.406: IC9.2 54.61,55.31 47.94,48.64 29.84,48.64 25.4,44.2 23.5,44.2 19.05,39.75 v8.26,39.75
SCK  (via drill 0.6)
  Top 0.254: IC5.4 84.95,46.39 84.53,46.81 84.22,46.81 82.39,44.99 79.38,44.99 76.99,47.37 76.99,49.59 75.56,51.02 v75.56,52.13
  Top 0.406: U$1.5 77.31,53.88 v75.56,52.13 | J2.3 | J2.3 73.66,25.46 73.66,24.19 71.75,22.29 62.87,22.29 61.59,23.56 61.59,32.45 IC9.19
  Bottom 0.406: v75.56,52.13 75.56,48.96 67.94,41.34 67.94,38.8 IC9.19
SCL  (via drill 0.5, 0.6)
  Top 0.406: IC8.6 60.96,17.84 v59.05,19.75 56.52,22.29 47.62,22.29 R16.1
  Top 0.61: IC2.6 87.31,59.44 v86.36,60.39
  Bottom 0.406: v59.05,19.75 59.05,52.77 IC9.28
  Bottom 0.61: v86.36,60.39 81.92,60.39 79.38,57.85 IC9.28
SDA  (via drill 0.5, 0.6)
  Top 0.406: 57.63,23.08 50.01,23.08 R15.1 | 57.63,23.08 | 57.63,23.08 v60.33,20.38 62.23,18.48 IC8.5
  Top 0.61: IC2.7 86.04,58.16 v85.09,59.12
  Bottom 0.406: v60.33,20.38 60.33,51.5 IC9.27
  Bottom 0.61: v85.09,59.12 83.19,59.12 79.38,55.31 IC9.27
SDCARD_CS  (via drill 0.5)
  Top 0.406: U$1.2 74.02,49.87 75.56,48.32 75.56,45.78 73.18,43.4 73.18,42.45 73.66,41.97 | v87,29.27 87,31.81 86.04,32.77 86.04,41.34 85.41,41.97 73.66,41.97 | 73.66,41.97 67.31,35.62 67.31,28 IC9.15
  Top 0.61: v88.9,27.37 R2.1
  Bottom 0.406: v87,29.27 v88.9,27.37
STATUS  (via drill 0.5)
  Top 0.406: v80.64,50.86 v83.82,47.69
  Bottom 0.406: v80.64,50.86 77.47,54.04 67.94,54.04 66.67,52.77 IC9.26 | v83.82,47.69 87,47.69 R18.2
TXD
  Top 0.406: S2.2 65.41,17.21 59.05,23.56 59.05,50.23 IC9.3
  Bottom 0.406: IC9.3 53.34,52.77 48.26,47.69 30.16,47.69 25.72,43.24 24.13,43.24 19.68,38.8 J4.2 | J4.2
TXD2
  Top 0.406: IC4.TXD 42.55,40.07 40.01,37.53 R6.1
  Top 0.61: R9.1 R6.1
V_BATT  (via drill 0.5)
  Top 0.61: 6.99,25.78 6.99,26.05
  Top 0.813: X2.1 5.07,26.09 D2.A 6.99,26.05 | v10.79,21.97 6.99,25.78
  Bottom 0.813: v10.79,21.97 11.75,21.02 R13.1 12.7,18.95 12.7,10.22 7.94,5.46 6.03,5.46 4.45,7.05 X3.1
VIN  (via drill 0.5)
  Top 0.406: D1.C | 7,15.87 D2.C | IC6.1 13.56,26.82 12.7,27.68 12.7,31.18 18.18,36.58 21.27,36.58 v24.13,39.43
  Top 0.61: C4.2 38.1,42.61 37.47,43.24 IC4.VCC | IC6.1 13.56,22.52 10.79,19.75 D1.C
  Top 0.813: D2.C D1.C | C9.+ 7,15.87
  Bottom 0.406: v24.13,39.43 36.2,39.43 C4.2
XBEE_RXD
  Bottom 0.406: IC3.2 43.2,31.8 41.59,33.4 41.59,39.75 52.07,50.23 IC9.4
XBEE_SLEEP
  Top 0.305: 29.2,30.56 IC3.9
  Top 0.406: IC3.9 29.2,47.04 31.11,48.96 43.18,48.96 53.34,59.12 57.47,59.12 62.23,54.35 62.23,49.59 IC9.24
  Top 0.61: 29.2,30.56 32.38,27.37 33.02,27.37 R10.1
XBEE_TXD
  Bottom 0.406: IC3.3 41.2,29.35 41.91,28.64 45.72,28.64 46.99,29.91 46.99,31.18 45.09,33.08 45.09,42.29 50.48,47.69 IC9.5

### Text on the board
tPlace: RadioMetrix HX1 or NTX2 RF Module, etc. | MICRO SD CARD | BMP085 | 100 nF | 22 pF | Auto-reset | 10 uF | 8 MHz | XBee Module | 1 | GND | D- | D+ | Arduino-compatible Mobile Sensor Datalogging Platform | Luke Weston, 2012 | Licensed under the CERN Open Hardware License (www.ohwr.org/cernohl) | CR1220 3V
tValues: DTR | TXD | RXD | FTDI Cable | +5V | 5V Power | 3.3V Logic | GND | GND | + | - | 100 uF